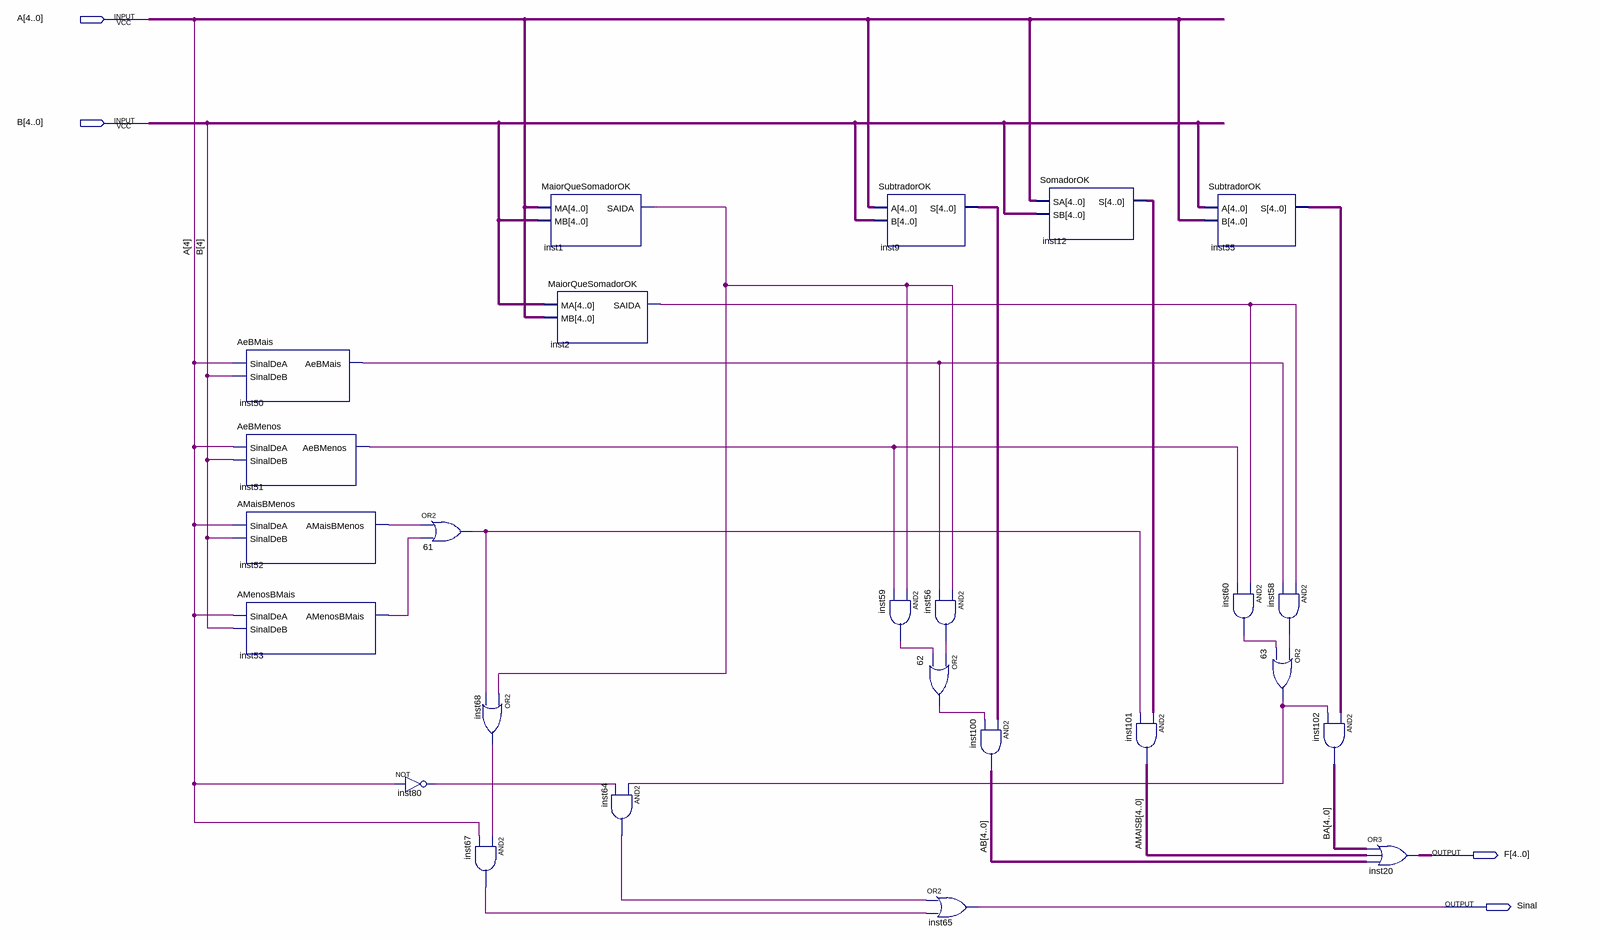
[diagram p0: schematic sheet]
// Quartus schematic SubtratorV1.bdf as structural Verilog: 25 symbols, 4 pins
module SubtratorV1 (
  input  [4:0] A,
  input  [4:0] B,
  output [4:0] F,
  output Sinal
);

  wire inst1_saida, inst2_saida, inst50_aebmais, inst51_aebmenos, inst52_amaisbmenos, inst53_amenosbmais,
       inst56_out, inst58_out, inst59_out, inst60_out, inst64_out, inst67_out, inst68_out, inst80_out,
       n61_out, n62_out, n63_out;
  wire [4:0] AB, AMAISB, BA, inst9_s, inst12_s, inst55_s;

  AeBMais inst50 (.SinalDeA(A[4]), .SinalDeB(B[4]), .AeBMais(inst50_aebmais));
  AeBMenos inst51 (.SinalDeA(A[4]), .SinalDeB(B[4]), .AeBMenos(inst51_aebmenos));
  AMaisBMenos inst52 (.SinalDeA(A[4]), .SinalDeB(B[4]), .AMaisBMenos(inst52_amaisbmenos));
  AMenosBMais inst53 (.SinalDeA(A[4]), .SinalDeB(B[4]), .AMenosBMais(inst53_amenosbmais));
  not inst80 (inst80_out, A[4]);
  or u_61 (n61_out, inst52_amaisbmenos, inst53_amenosbmais);
  or inst68 (inst68_out, inst1_saida, n61_out);
  and inst67 (inst67_out, inst68_out, A[4]);
  MaiorQueSomadorOK inst1 (.MA(A), .MB(B), .SAIDA(inst1_saida));
  MaiorQueSomadorOK inst2 (.MA(B), .MB(A), .SAIDA(inst2_saida));
  and inst64 (inst64_out, n63_out, inst80_out);
  SubtradorOK inst9 (.A(A), .B(B), .S(inst9_s));
  and inst59 (inst59_out, inst1_saida, inst51_aebmenos);
  and inst56 (inst56_out, inst1_saida, inst50_aebmais);
  or u_62 (n62_out, inst56_out, inst59_out);
  or inst65 (Sinal, inst64_out, inst67_out);
  assign AB = inst9_s & {5{n62_out}};  // AND2 inst100, 5 bits wide
  SomadorOK inst12 (.SA(A), .SB(B), .S(inst12_s));
  assign AMAISB = inst12_s & {5{n61_out}};  // AND2 inst101, 5 bits wide
  SubtradorOK inst55 (.A(B), .B(A), .S(inst55_s));
  and inst60 (inst60_out, inst2_saida, inst51_aebmenos);
  and inst58 (inst58_out, inst2_saida, inst50_aebmais);
  or u_63 (n63_out, inst58_out, inst60_out);
  assign BA = inst55_s & {5{n63_out}};  // AND2 inst102, 5 bits wide
  assign F = BA | AMAISB | AB;  // OR3 inst20, 5 bits wide
endmodule
